# Altium schematic sheet DSP2.SchDoc
size A
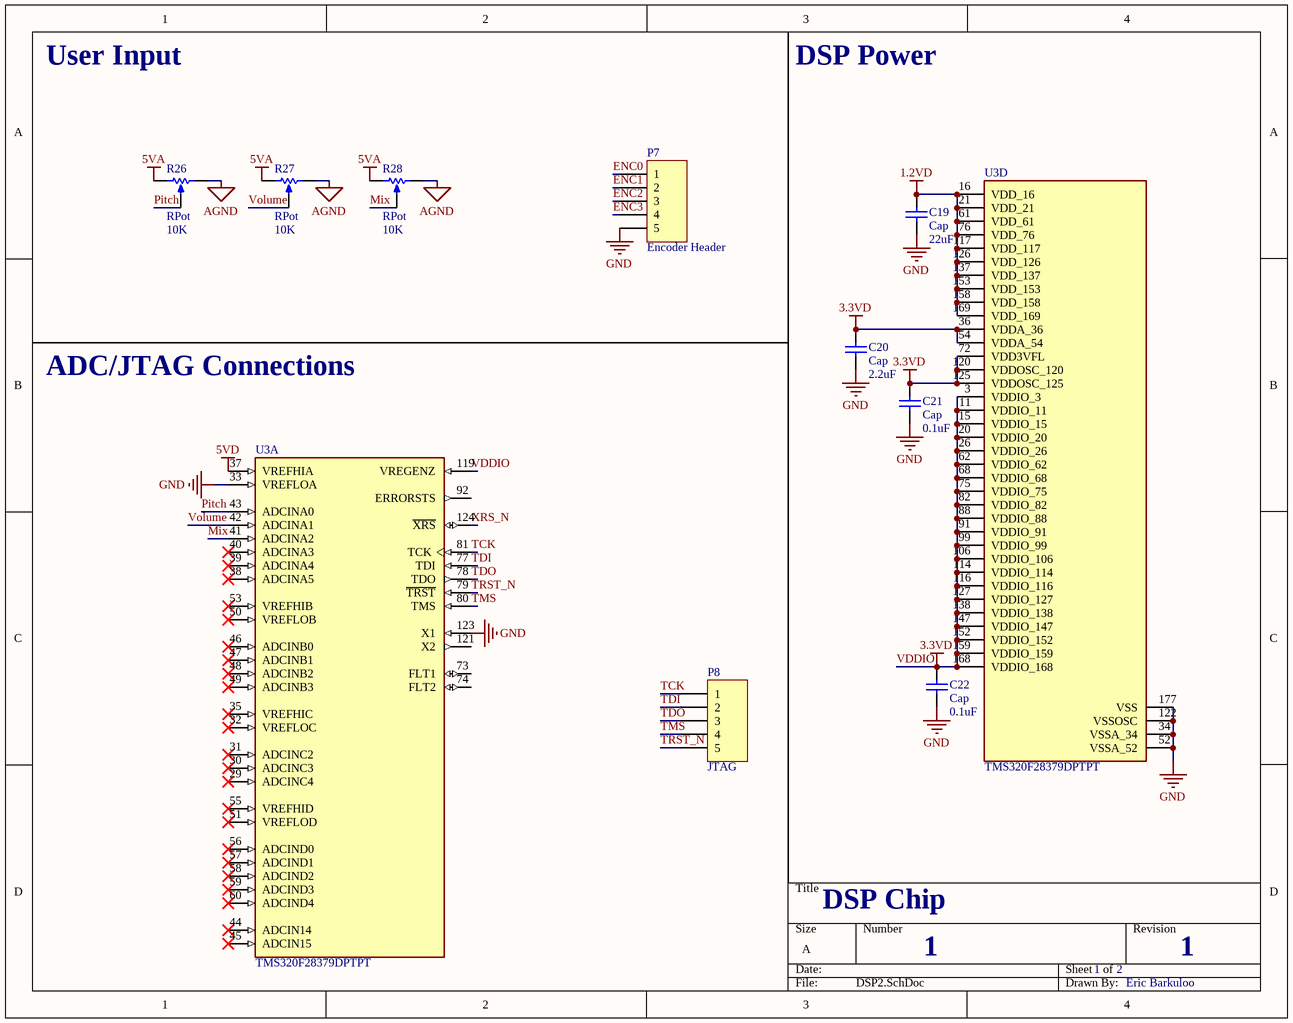
[diagram p0: DSP2.SchDoc]

## Parts
C19  Cap  value 22uF  [RAD-0.3]
C20  Cap  value 2.2uF  [RAD-0.3]
C21  Cap  value 0.1uF  [RAD-0.3]
C22  Cap  value 0.1uF  [RAD-0.3]
P7  Encoder Header  [HDR1X5]
P8  JTAG  [HDR1X5]
R26  RPot  value 10K  [VR5]
R27  RPot  value 10K  [VR5]
R28  RPot  value 10K  [VR5]
U3  TMS320F28379DPTPT  [IC_TMS320F28379DPTPT]  (parts A,D of 4)

## Nets
1.2VD: C19.2 U3.16(VDD_16) U3.21(VDD_21) U3.61(VDD_61) U3.76(VDD_76) U3.117(VDD_117) U3.126(VDD_126) U3.137(VDD_137) U3.153(VDD_153) U3.158(VDD_158) U3.169(VDD_169)
5VA: R26.1(TOP) R27.1(TOP) R28.1(TOP)
5VD: U3.37(VREFHIA)
AGND: R26.2(BOT) R27.2(BOT) R28.2(BOT)
GND: C19.1 C20.1 C21.1 C22.1 P7.5 U3.33(VREFLOA) U3.34(VSSA_34) U3.52(VSSA_52) U3.122(VSSOSC) U3.123(X1) U3.177(VSS)
VDDIO: C20.2 C21.2 C22.2 U3.3(VDDIO_3) U3.11(VDDIO_11) U3.15(VDDIO_15) U3.20(VDDIO_20) U3.26(VDDIO_26) U3.36(VDDA_36) U3.54(VDDA_54) U3.62(VDDIO_62) U3.68(VDDIO_68) U3.72(VDD3VFL) U3.75(VDDIO_75) U3.82(VDDIO_82) U3.88(VDDIO_88) U3.91(VDDIO_91) U3.99(VDDIO_99) U3.106(VDDIO_106) U3.114(VDDIO_114) U3.116(VDDIO_116) U3.119(VREGENZ) U3.120(VDDOSC_120) U3.125(VDDOSC_125) U3.127(VDDIO_127) U3.138(VDDIO_138) U3.147(VDDIO_147) U3.152(VDDIO_152) U3.159(VDDIO_159) U3.168(VDDIO_168)  [also labelled 3.3VD]
ENC0: P7.1
ENC1: P7.2
ENC2: P7.3
ENC3: P7.4
Mix: R28.3(TAP) U3.41(ADCINA2)
Pitch: R26.3(TAP) U3.43(ADCINA0)
TCK: P8.1 U3.81(TCK)
TDI: P8.2 U3.77(TDI)
TDO: P8.3 U3.78(TDO)
TMS: P8.4 U3.80(TMS)
TRST_N: P8.5 U3.79(~{TRST})
Volume: R27.3(TAP) U3.42(ADCINA1)
XRS_N: U3.124(~{XRS})

Not connected (* = marked no-connect by the designer): U3 29(ADCINC4)* 30(ADCINC3)* 31(ADCINC2)* 32(VREFLOC)* 35(VREFHIC)* 38(ADCINA5)* 39(ADCINA4)* 40(ADCINA3)* 44(ADCIN14)* 45(ADCIN15)* 46(ADCINB0)* 47(ADCINB1)* 48(ADCINB2)* 49(ADCINB3)* 50(VREFLOB)* 51(VREFLOD)* 53(VREFHIB)* 55(VREFHID)* 56(ADCIND0)* 57(ADCIND1)* 58(ADCIND2)* 59(ADCIND3)* 60(ADCIND4)* 73(FLT1) 74(FLT2) 92(ERRORSTS) 121(X2)

## Notes on the sheet
- User Input
- DSP Power
- ADC/JTAG Connections
- DSP Chip
- 1
- 2
- Eric Barkuloo

## Library data of the parts
C19-C22 = Cap: Capacitor; Published: 8-Jun-2000; LatestRevisionDate: 17-Jul-2002; LatestRevisionNote: Re-released for DXP Platform.; PackageReference: RAD-0.3; Publisher: Altium Limited; PackageDescription: Radial Cap, Thru-Hole; 2 Leads; 0.3 in Pin Spacing
P7 P8 = Header 5: Header, 5-Pin; LatestRevisionDate: 17-Jul-2002; LatestRevisionNote: Re-released for DXP Platform.; Publisher: Altium Limited
R26-R28 = RPot: Potentiometer; Sim Note: Enter the Resistance value and the set point into parameter fields.; Set Position: 0.5; Published: 8-Jun-2000; LatestRevisionDate: 17-Jul-2002; LatestRevisionNote: Re-released for DXP Platform.; PackageReference: VR5; Publisher: Altium Limited; PackageDescription: Variable Resistor, Thru-Hole; 3 Leads
U3 = TMS320F28379DPTPT: C2000 32-bit MCU with 800 MIPS, 2xCPU, 2xCLA, FPU, TMU, 1024 KB Flash, CLB, EMIF, 16b ADC 176-HLQFP -40 to 105; Price: None; Package: None; Availability: Unavailable; MP: TMS320F28379DPTPT; Value: *